# Altium schematic sheet MCU.SchDoc
size A4; SheetNumber: 2; SheetTotal: 2
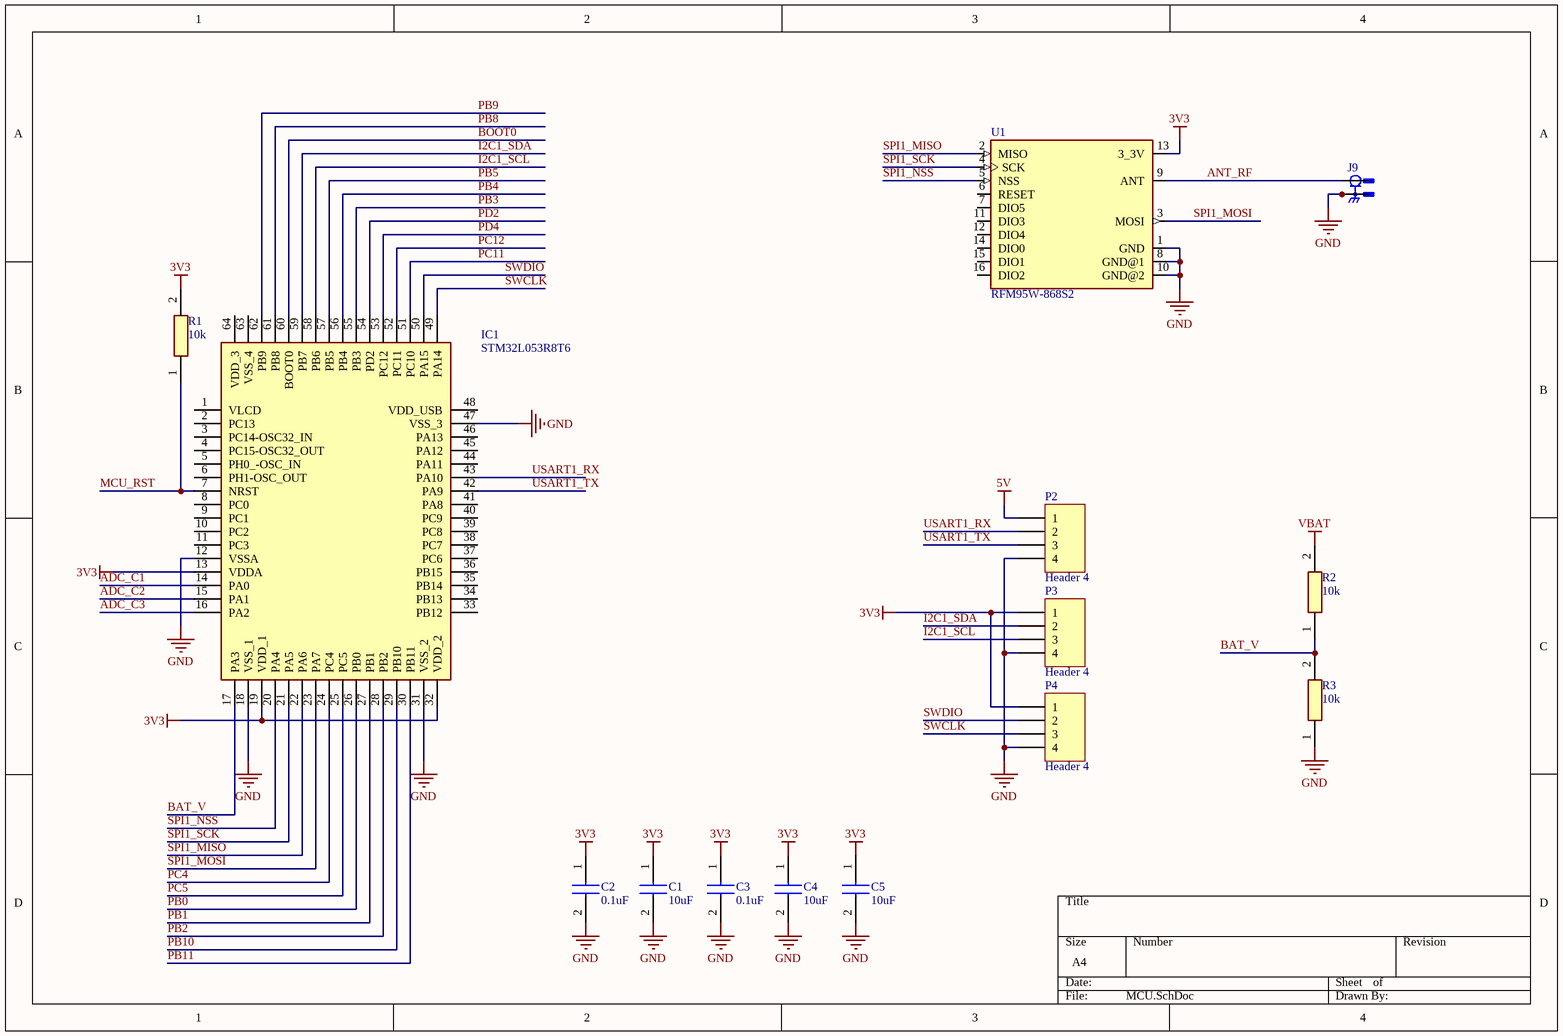
[diagram p0: MCU.SchDoc]

## Parts
C1  10uF  [CAPC2012X94N]
C2  0.1uF  [CAPC2012X94N]
C3  0.1uF  [CAPC2012X94N]
C4  10uF  [CAPC2012X94N]
C5  10uF  [CAPC2012X94N]
IC1  STM32L053R8T6  [QFP50P1200X1200X160-64N]
J9  CONSMA013.062-G  [LINX_CONSMA013.062-G]  (value not drawn)
P2  Header 4  [HDR1X4]
P3  Header 4  [HDR1X4]
P4  Header 4  [HDR1X4]
R1  10k  [RESC2012X65N]
R2  10k  [RESC2012X65N]
R3  10k  [RESC2012X65N]
U1  RFM95W-868S2  [XCVR_RFM95W-868S2]

## Nets
3V3: C1.1 C2.1 C3.1 C4.1 C5.1 IC1.13(VDDA) IC1.19(VDD_1) IC1.32(VDD_2) P3.1 P4.1 R1.2 U1.13(3_3V)
5V: P2.1
GND: C1.2 C2.2 C3.2 C4.2 C5.2 IC1.12(VSSA) IC1.18(VSS_1) IC1.31(VSS_2) IC1.47(VSS_3) J9.S1 J9.S2 J9.S3 J9.S4 P2.4 P3.4 P4.4 R3.1 U1.1(GND) U1.8(GND@1) U1.10(GND@2)
VBAT: R2.2
ADC_C1: IC1.14(PA0)
ADC_C2: IC1.15(PA1)
ADC_C3: IC1.16(PA2)
ANT_RF: J9.1 U1.9(ANT)
BAT_V: IC1.17(PA3) R2.1 R3.2
BOOT0: IC1.60(BOOT0)
I2C1_SCL: IC1.58(PB6) P3.3
I2C1_SDA: IC1.59(PB7) P3.2
MCU_RST: IC1.7(NRST) R1.1
PB0: IC1.26(PB0)
PB1: IC1.27(PB1)
PB2: IC1.28(PB2)
PB3: IC1.55(PB3)
PB4: IC1.56(PB4)
PB5: IC1.57(PB5)
PB8: IC1.61(PB8)
PB9: IC1.62(PB9)
PB10: IC1.29(PB10)
PB11: IC1.30(PB11)
PC4: IC1.24(PC4)
PC5: IC1.25(PC5)
PC11: IC1.51(PC10)
PC12: IC1.52(PC11)
PD2: IC1.54(PD2)
PD4: IC1.53(PC12)
SPI1_MISO: IC1.22(PA6) U1.2(MISO)
SPI1_MOSI: IC1.23(PA7) U1.3(MOSI)
SPI1_NSS: IC1.20(PA4) U1.5(NSS)
SPI1_SCK: IC1.21(PA5) U1.4(SCK)
SWCLK: IC1.49(PA14) P4.3
SWDIO: IC1.50(PA15) P4.2
USART1_RX: IC1.43(PA10) P2.2
USART1_TX: IC1.42(PA9) P2.3

Not connected (* = marked no-connect by the designer): IC1 1(VLCD) 2(PC13) 3(PC14-OSC32_IN) 4(PC15-OSC32_OUT) 5(PH0_-OSC_IN) 6(PH1-OSC_OUT) 8(PC0) 9(PC1) 10(PC2) 11(PC3) 33(PB12) 34(PB13) 35(PB14) 36(PB15) 37(PC6) 38(PC7) 39(PC8) 40(PC9) 41(PA8) 44(PA11) 45(PA12) 46(PA13) 48(VDD_USB) 63(VSS_4) 64(VDD_3); U1 6(RESET) 7(DIO5) 11(DIO3) 12(DIO4) 14(DIO0) 15(DIO1) 16(DIO2)

## Library data of the parts
C1-C5 = 08055A130JAT2A: Capacitor; Manufacturer_Name: AVX; Datasheet Link: https://componentsearchengine.com/Datasheets/1/06031A100FAT2A.pdf; Height: 0.94mm; Manufacturer_Part_Number: 08055A130JAT2A; Mouser Part Number: 581-08055A130JAT2A; Mouser Price/Stock: https://www.mouser.com/Search/Refine.aspx?Keyword=581-08055A130JAT2A
IC1 = STM32L053R8T6: Integrated Circuit; Manufacturer_Name: STMicroelectronics; Datasheet Link: https://www.st.com/resource/en/datasheet/stm32l053c6.pdf; Height: 1.6mm; Manufacturer_Part_Number: STM32L053R8T6; Mouser Part Number: 511-STM32L053R8T6; Mouser Price/Stock: https://www.mouser.co.uk/ProductDetail/STMicroelectronics/STM32L053R8T6?qs=s5SkPsIz109btNVTZ3cqlw%3D%3D; Arrow Part Number: STM32L053R8T6; Arrow Price/Stock: https://www.arrow.com/en/products/stm32l053r8t6/stmicroelectronics
J9 = CONSMA013.062-G: SMA MALE EDGE MOUNT FOR 0.031" THICK BOARD; Availability: Unavailable; Price: None; Package: None; MP: CONSMA013.062-G; Value: *
P2-P4 = Header 4: Header, 4-Pin; LatestRevisionDate: 17-Jul-2002; LatestRevisionNote: Re-released for DXP Platform.; Publisher: Altium Limited
R1-R3 = CPF0805B102RE1: Resistor; Manufacturer_Name: TE Connectivity; Datasheet Link: https://datasheet.datasheetarchive.com/originals/distributors/DKDS-21/401696.pdf; Height: 0.65mm; Manufacturer_Part_Number: CPF0805B102RE1
U1 = RFM95W-868S2: Mod Txrx Lora +20dbm 868mhz Smd; Value: *; MP: RFM95W-868S2; Availability: Unavailable; Package: None; Price: None